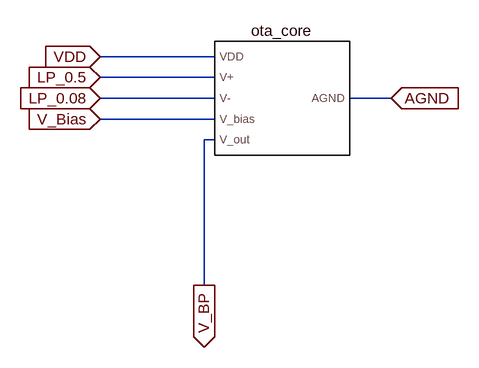
[diagram p0: schematic ota_bandpass.asc]
ota_bandpass.asc, the LTspice schematic file:
Version 4.1
SHEET 1 880 680
WIRE 112 112 -64 112
WIRE 112 144 -64 144
WIRE 112 176 -64 176
WIRE 384 176 320 176
WIRE 112 208 -64 208
WIRE 112 240 96 240
WIRE 96 464 96 240
FLAG -64 144 LP_0.5
IOPIN -64 144 In
FLAG -64 176 LP_0.08
IOPIN -64 176 In
FLAG 96 464 V_BP
IOPIN 96 464 Out
FLAG -64 112 VDD
IOPIN -64 112 In
FLAG -64 208 V_Bias
IOPIN -64 208 In
FLAG 384 176 AGND
IOPIN 384 176 In
SYMBOL ota_core 208 176 R0
SYMATTR InstName ota_core

The netlist it stands for:
* ota_bandpass.asc
X§ota_core VDD LP_0.5 LP_0.08 V_Bias V_BP AGND ota_core  ; pins VDD V+ V- V_bias V_out AGND
.backanno
.end